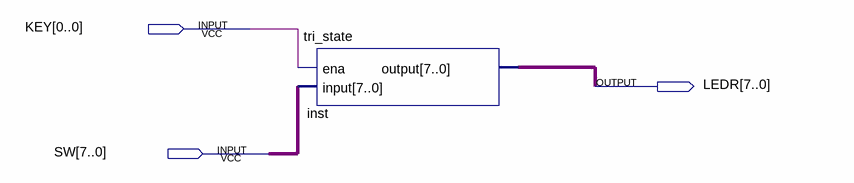
[diagram p0: schematic sheet]
// Quartus schematic tri_state_buffer.bdf as structural Verilog: 1 symbols, 3 pins
module tri_state_buffer (
  input  [0:0] KEY,
  input  [7:0] SW,
  output [7:0] LEDR
);

  tri_state inst (.ena(KEY[0]), .\input (SW), .\output (LEDR));
endmodule
